# Altium project Mobile Robot.PrjPcb
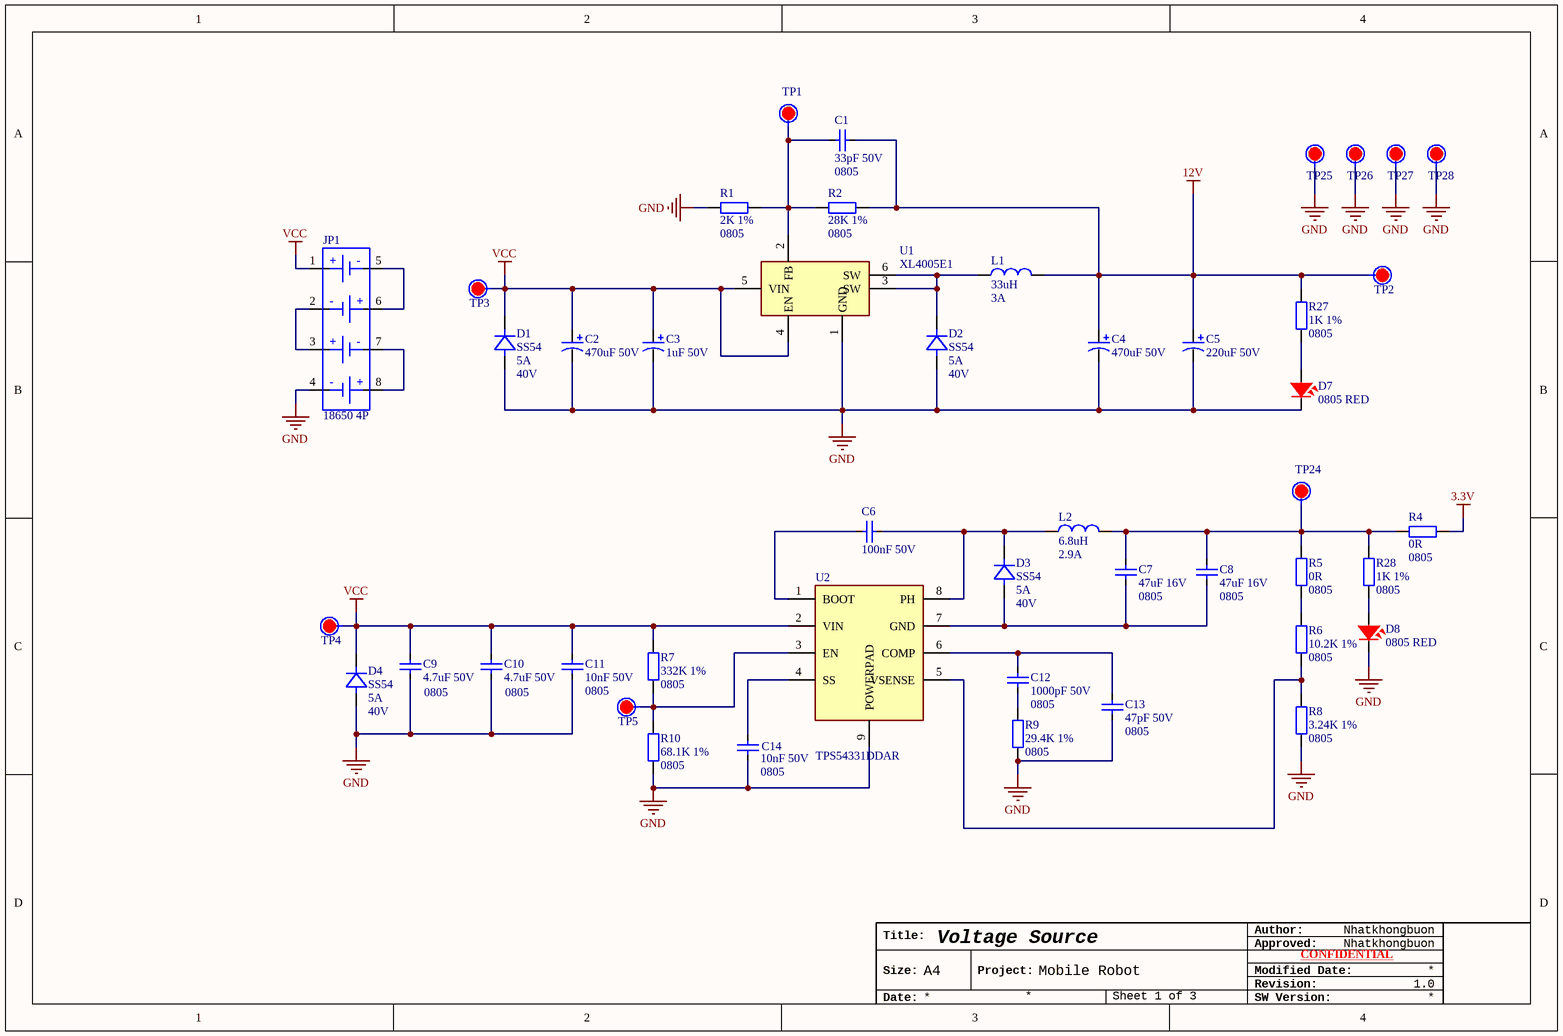
[diagram p0: Voltage Source.SchDoc]
3 sheets, 112 parts. Net scope: global (net labels, ports and power ports of the same name join across sheets).
Board file: PCB.PcbDoc
Sheets:
  Voltage Source.SchDoc
  MCU.SchDoc
  Driver.SchDoc

## Sheet Voltage Source.SchDoc: Voltage Source
size A4; ApprovedBy: Nhatkhongbuon; Author: Nhatkhongbuon; Revision: 1.0; SheetNumber: 1; SheetTotal: 3; ProjectTitle: Mobile Robot

### Parts
C1  33pF 50V  Size: 0805  [CAP_SMD_0805_NEW]
C2  470uF 50V  [CAP-ALU-SMD-D12.5xL13.5]
C3  1uF 50V  [CAP-ALU-SMD-B -NEW]
C4  470uF 50V  [CAP-ALU-SMD-D12.5xL13.5]
C5  220uF 50V  [CAP-ALU-SMD-G-NEW]
C6  100nF 50V  [CAP_SMD_0805_NEW]
C7  47uF 16V  Size: 0805  [CAP_SMD_0805_NEW]
C8  47uF 16V  Size: 0805  [CAP_SMD_0805_NEW]
C9  4.7uF 50V  Size: 0805  [CAP_SMD_0805_NEW]
C10  4.7uF 50V  Size: 0805  [CAP_SMD_0805_NEW]
C11  10nF 50V  Size: 0805  [CAP_SMD_0805_NEW]
C12  1000pF 50V  Size: 0805  [CAP_SMD_0805_NEW]
C13  47pF 50V  Size: 0805  [CAP_SMD_0805_NEW]
C14  10nF 50V  Size: 0805  [CAP_SMD_0805_NEW]
D1  SS54  Current: 5A  DC Voltage: 40V  [SMA]
D2  SS54  Current: 5A  DC Voltage: 40V  [SMA]
D3  SS54  Current: 5A  DC Voltage: 40V  [SMA]
D4  SS54  Current: 5A  DC Voltage: 40V  [SMA]
D7  0805 RED  [LED-0805-Red]
D8  0805 RED  [LED-0805-Red]
JP1  18650 4P  [18650 Holder 4P]
L1  Inductor: 33uH  Current: 3A  [L_TOR_13x7]  (hidden comment: 33uH 3A)
L2  Inductor: 6.8uH  Current: 2.9A  [CD74R]  (hidden comment: CD74R_6.8uH)
R1  2K 1%  Size: 0805  [RES_SMD_0805]
R2  28K 1%  Size: 0805  [RES_SMD_0805]
R4  0R  Size: 0805  [RES_SMD_0805]
R5  0R  Size: 0805  [RES_SMD_0805]
R6  10.2K 1%  Size: 0805  [RES_SMD_0805]
R7  332K 1%  Size: 0805  [RES_SMD_0805]
R8  3.24K 1%  Size: 0805  [RES_SMD_0805]
R9  29.4K 1%  Size: 0805  [RES_SMD_0805]
R10  68.1K 1%  Size: 0805  [RES_SMD_0805]
R27  1K 1%  Size: 0805  [RES_SMD_0805]
R28  1K 1%  Size: 0805  [RES_SMD_0805]
TP1  Test Point  [TEST_POINT]  (value not drawn)
TP2  Test Point  [TEST_POINT]  (value not drawn)
TP3  Test Point  [TEST_POINT]  (value not drawn)
TP4  Test Point  [TEST_POINT]  (value not drawn)
TP5  Test Point  [TEST_POINT]  (value not drawn)
TP24  Test Point  [TEST_POINT]  (value not drawn)
TP25  Test Point  [TEST_POINT]  (value not drawn)
TP26  Test Point  [TEST_POINT]  (value not drawn)
TP27  Test Point  [TEST_POINT]  (value not drawn)
TP28  Test Point  [TEST_POINT]  (value not drawn)
U1  XL4005E1  [TO263-5]
U2  TPS54331DDAR  [TPS54531DDAR]

### Nets
3.3V: R4.1
12V: C1.2 C4.1 C5.1 L1.2 R2.2 R27.1 TP2.1
GND: C2.2 C3.2 C4.2 C5.2 C9.1 C10.1 C11.1 C13.1 C14.1 D1.A D2.A D4.A D7.2 D8.2 JP1.4 R1.1 R8.1 R9.1 R10.1 TP25.1 TP26.1 TP27.1 TP28.1 U1.1(GND) U2.9(POWERPAD)
VCC: C2.1 C3.1 C9.2 C10.2 C11.2 D1.C D4.C JP1.1 R7.2 TP3.1 TP4.1 U1.4(EN) U1.5(VIN) U2.2(VIN)
NetC1_1: C1.1 R1.2 R2.1 TP1.1 U1.2(FB)
NetC6_1: C6.1 U2.1(BOOT)
NetC6_2: C6.2 D3.C L2.1 U2.8(PH)
NetC7_1: C7.1 C8.1 D3.A U2.7(GND)
NetC7_2: C7.2 C8.2 L2.2 R4.2 R5.2 R28.1 TP24.1
NetC12_1: C12.1 R9.2
NetC12_2: C12.2 C13.2 U2.6(COMP)
NetC14_2: C14.2 U2.4(SS)
NetD2_C: D2.C L1.1 U1.3(SW) U1.6(SW)
NetD7_1: D7.1 R27.2
NetD8_1: D8.1 R28.2
NetJP1_2: JP1.2 JP1.3
NetJP1_5: JP1.5 JP1.6
NetJP1_7: JP1.7 JP1.8
NetR5_1: R5.1 R6.2
NetR6_1: R6.1 R8.2 U2.5(VSENSE)
NetR7_1: R7.1 R10.2 TP5.1 U2.3(EN)

### Notes on the sheet
- Author:
- Title:
- Size:
- A4
- Project:
- Approved:
- Revision:
- Modified Date:
- CONFIDENTIAL
- Date:
- SW Version:
- (in symbol 18650_HLD_4P) +; -
- (in symbol XL4005E1) /

### Library data of the parts
C1 = C0805_MLCC_33pF_50V: 33 pF ±10% 50V Ceramic Capacitor C0G, NP0 0805 (2012 Metric); Manufacturer: KEMET; Manufacture Part Number: C0805C330K5GAC7800; Packaging: Cut Tape (CT); Link: https://www.digikey.com/en/products/detail/kemet/C0805C330K5GAC7800/2212525; Price: $0.10
C2 C4 = C_ALU_470uF_50V: 470uF 50V ±20% SMD,D12.5xL13.5mm Aluminum Electrolytic Capacitors - SMD ROHS; Manufacturer: Changzhou Huawei Elec; Manufacture Part Number: VT1H471MI135000CE0; Link: https://www.lcsc.com/product-detail/Aluminum-Electrolytic-Capacitors-SMD_Changzhou-Huawei-Elec-VT1H471MI135000CE0_C191227.html; Price: $ 0.36
C3 = C_ALU_1uF_50V_B: 1uF 50V 7mA@120Hz ±20% SMD,D4xL5.4mm Aluminum Electrolytic Capacitors - SMD ROHS; Manufacturer: KNSCHA; Manufacture Part Number: RST1UF50V017; Packaging: Cut Tape; Link: https://www.lcsc.com/product-detail/Aluminum-Electrolytic-Capacitors-SMD_KNSCHA-RST1UF50V017_C4747972.html; Price: $ 0.0209
C5 = C_ALU_220uF_50V_G: 220uF 50V 220mA@120Hz ±20% SMD,D10xL10.5mm Aluminum Electrolytic Capacitors - SMD ROHS; Manufacturer: KNSCHA; Manufacture Part Number: XT220UF50V90RV0078; Packaging: Cut Tape (CT); Link: https://www.lcsc.com/product-detail/Aluminum-Electrolytic-Capacitors-SMD_KNSCHA-XT220UF50V90RV0078_C2992609.html; Price: $ 0.1071
C6 = C0805_MLCC_100nF_50V: 0.1 µF ±10% 50V Ceramic Capacitor X7R 0805 (2012 Metric); Manufacturer: YAGEO; Manufacture Part Number: CC0805KRX7R9BB104; Packaging: Cut Tape (CT); Link: https://www.digikey.cn/en/products/detail/yageo/CC0805KRX7R9BB104/302874; Price: $0.10; Size: 0805
C7 C8 = C0805_MLCC_47uF_16V: 47 µF ±10% 16V Ceramic Capacitor X5R 1210 (3225 Metric); Manufacturer: Samsung Electro-Mechanics; Manufacture Part Number: CL32A476KOJNNNE; Packaging: Cut Tape (CT); Link: https://www.digikey.cn/en/products/detail/samsung-electro-mechanics/CL32A476KOJNNNE/3889034; Price: $0.51
C9 C10 = C0805_MLCC_4.7uF_50V: 4.7 µF ±10% 50V Ceramic Capacitor X5R 0805 (2012 Metric); Manufacturer: Samsung Electro-Mechanics; Manufacture Part Number: CL21A475KBQNNNE; Packaging: Cut Tape (CT); Link: https://www.digikey.cn/en/products/detail/samsung-electro-mechanics/CL21A475KBQNNNE/3886906; Price: $0.23
C11 C14 = C0805_MLCC_10nF_50V: 10000 pF ±10% 50V Ceramic Capacitor X7R 0805 (2012 Metric); Manufacturer: Samsung Electro-Mechanics; Manufacture Part Number: CL21B103KBANNNC; Packaging: Cut Tape (CT); Link: https://www.digikey.cn/en/products/detail/samsung-electro-mechanics/CL21B103KBANNNC/3886673; Price: $0.10
C12 = C0805_MLCC_1000pF_50V: 1000 pF ±10% 50V Ceramic Capacitor X7R 0805 (2012 Metric); Manufacturer: KEMET; Manufacture Part Number: C0805C102K5RAC7800; Packaging: Cut Tape (CT); Link: https://www.digikey.cn/en/products/detail/kemet/C0805C102K5RAC7800/411146; Price: $0.11
C13 = C0805_MLCC_47pF_50V: 47 pF ±5% 50V Ceramic Capacitor C0G, NP0 0805 (2012 Metric); Manufacturer: YAGEO; Manufacture Part Number: CC0805JRNPO9BN470; Packaging: Cut Tape (CT); Link: https://www.digikey.cn/en/products/detail/yageo/CC0805JRNPO9BN470/302841; Price: $0.10
D1-D4 = SS54: DIODE SCHOTTKY 40V 5A SMA; Manufacturer: EVVO; Manufacture Part Number: SS54; Packaging: Cut Tape (CT); Link: https://www.digikey.cn/en/products/detail/evvo/SS54/21407219; Price: $0.73
D7 D8 = LED_0805_RED: Red 625nm LED Indication - Discrete 2V 0805 (2012 Metric); Manufacturer: Würth Elektronik; Manufacture Part Number: 150080RS75000; Packaging: Cut Tape (CT); Link: https://www.digikey.cn/en/products/detail/w%C3%BCrth-elektronik/150080RS75000/4489918; Price: $0.19
JP1 = 18650_HLD_4P: 18650 Holder 4P; VNese Price: 17000; Link Shopee: https://linhkienchatluong.vn/de-pin---mu-pin/de-4-pin-18650-chan-han-mach-pcb_sp541_ct11852.aspx
L1 = L_33uH_3A: Toroidal Coil Inductor 33uH 3A; VNese Price: 3200; Link Shopee: https://linhkienchatluong.vn/cuon-cam-xuyen/cuon-cam-xuyen-33uh-3a_sp469_ct146.aspx
L2 = CD74R_6.8uH: 2.9A 6.8uH ±30% SMD,7.5x7.5mm Power Inductors ROHS; Manufacturer: SHOU HAN; Manufacture Part Number: CYH74-6.8UH; Link: https://www.lcsc.com/product-detail/Power-Inductors_SHOU-HAN-CYH74-6-8UH_C19268626.html; Price: $ 0.0674
R1 = R0805_2K: 2 kOhms ±1% 0.125W, 1/8W Chip Resistor 0805 (2012 Metric) Automotive AEC-Q200 Thick Film; Manufacturer: Panasonic Electronic Components; Manufacture Part Number: ERJ-6ENF2001V; Packaging: Cut Tape (CT); Link: https://www.digikey.com/en/products/detail/panasonic-electronic-components/ERJ-6ENF2001V/111341; Price: $0.10
R2 = R0805_28K: 28 kOhms ±1% 0.125W, 1/8W Chip Resistor 0805 (2012 Metric) Moisture Resistant Thick Film; Manufacturer: YAGEO; Manufacture Part Number: RC0805FR-0728KL; Packaging: Cut Tape (CT); Link: https://www.digikey.com/en/products/detail/yageo/RC0805FR-0728KL/727788; Price: $0.10
R4 R5 = R0805_0R: 0 Ohms Jumper Chip Resistor 0805 (2012 Metric) Automotive AEC-Q200 Thick Film; Manufacturer: Vishay Dale; Manufacture Part Number: CRCW08050000Z0EA; Packaging: Cut Tape (CT); Link: https://www.digikey.cn/en/products/detail/vishay-dale/CRCW08050000Z0EA/1175125; Price: $0.10
R6 = R0805_10.2K: 10.2 kOhms ±1% 0.125W, 1/8W Chip Resistor 0805 (2012 Metric) Moisture Resistant Thick Film; Manufacturer: YAGEO; Manufacture Part Number: RC0805FR-0710K2L; Packaging: Cut Tape (CT); Link: https://www.digikey.cn/en/products/detail/yageo/RC0805FR-0710K2L/727538; Price: $0.10
R7 = R0805_332K: 332 kOhms ±1% 0.125W, 1/8W Chip Resistor 0805 (2012 Metric) Moisture Resistant Thick Film; Manufacturer: YAGEO; Manufacture Part Number: RC0805FR-07332KL; Packaging: Cut Tape (CT); Price: $0.10; Link: https://www.digikey.cn/en/products/detail/yageo/RC0805FR-07332KL/727869
R8 = R0805_3.24K: 3.24 kOhms ±1% 0.125W, 1/8W Chip Resistor 0805 (2012 Metric) Moisture Resistant Thick Film; Manufacturer: YAGEO; Manufacture Part Number: RC0805FR-073K24L; Packaging: Cut Tape (CT); Link: https://www.digikey.cn/en/products/detail/yageo/RC0805FR-073K24L/727811; Price: $0.10
R9 = R0805_29.4K: 29.4 kOhms ±1% 0.125W, 1/8W Chip Resistor 0805 (2012 Metric) Moisture Resistant Thick Film; Manufacturer: YAGEO; Manufacture Part Number: RC0805FR-0729K4L; Packaging: Cut Tape (CT); Price: $0.10; Link: https://www.digikey.cn/en/products/detail/yageo/RC0805FR-0729K4L/727796
R10 = R0805_68.1K: 68.1 kOhms ±1% 0.125W, 1/8W Chip Resistor 0805 (2012 Metric) Moisture Resistant Thick Film; Manufacturer: YAGEO; Manufacture Part Number: RC0805FR-0768K1L; Packaging: Cut Tape (CT); Price: $0.10; Link: https://www.digikey.cn/en/products/detail/yageo/RC0805FR-0768K1L/728100?s=N4IgTCBcDaIEoGEAMAOJBWAYnAtEg7AGwoDSAjADIgC6AvkA
R27 R28 = R0805_1K: 1 kOhms ±1% 0.125W, 1/8W Chip Resistor 0805 (2012 Metric) Moisture Resistant Thick Film; Manufacturer: YAGEO; Manufacture Part Number: 311-1.00KCRCT-ND; Packaging: Cut Tape (CT); Link: https://www.digikey.com/en/products/detail/yageo/RC0805FR-071KL/727444; Price: $0.10
TP1-TP5 TP24-TP28 = TEST_POINT
U1 = XL4005E1: Step-down type 800mV~30V 5A 5V~32V TO-263-5 DC-DC Converters ROHS; Manufacturer: XLSEMI; Manufacture Part Number: XL4005E1; Link: https://www.lcsc.com/product-detail/DC-DC-Converters_XLSEMI-XL4005E1_C73332.html; Price: $0.68
U2 = TPS54331DDAR: Buck Switching Regulator IC Positive Adjustable 0.8V 1 Output 3A 8-PowerSOIC (0.154", 3.90mm Width); Manufacturer: Texas Instruments; Manufacture Part Number: TPS54331DDAR; Packaging: Cut Tape; Link: https://www.digikey.cn/en/products/detail/texas-instruments/TPS54331DDAR/3053257; Price: $1.88

## Sheet MCU.SchDoc: MCU
size A4; ApprovedBy: Nhatkhongbuon; Author: Nhatkhongbuon; Revision: 1.0; SheetNumber: 2; SheetTotal: 3; ProjectTitle: Mobile Robot
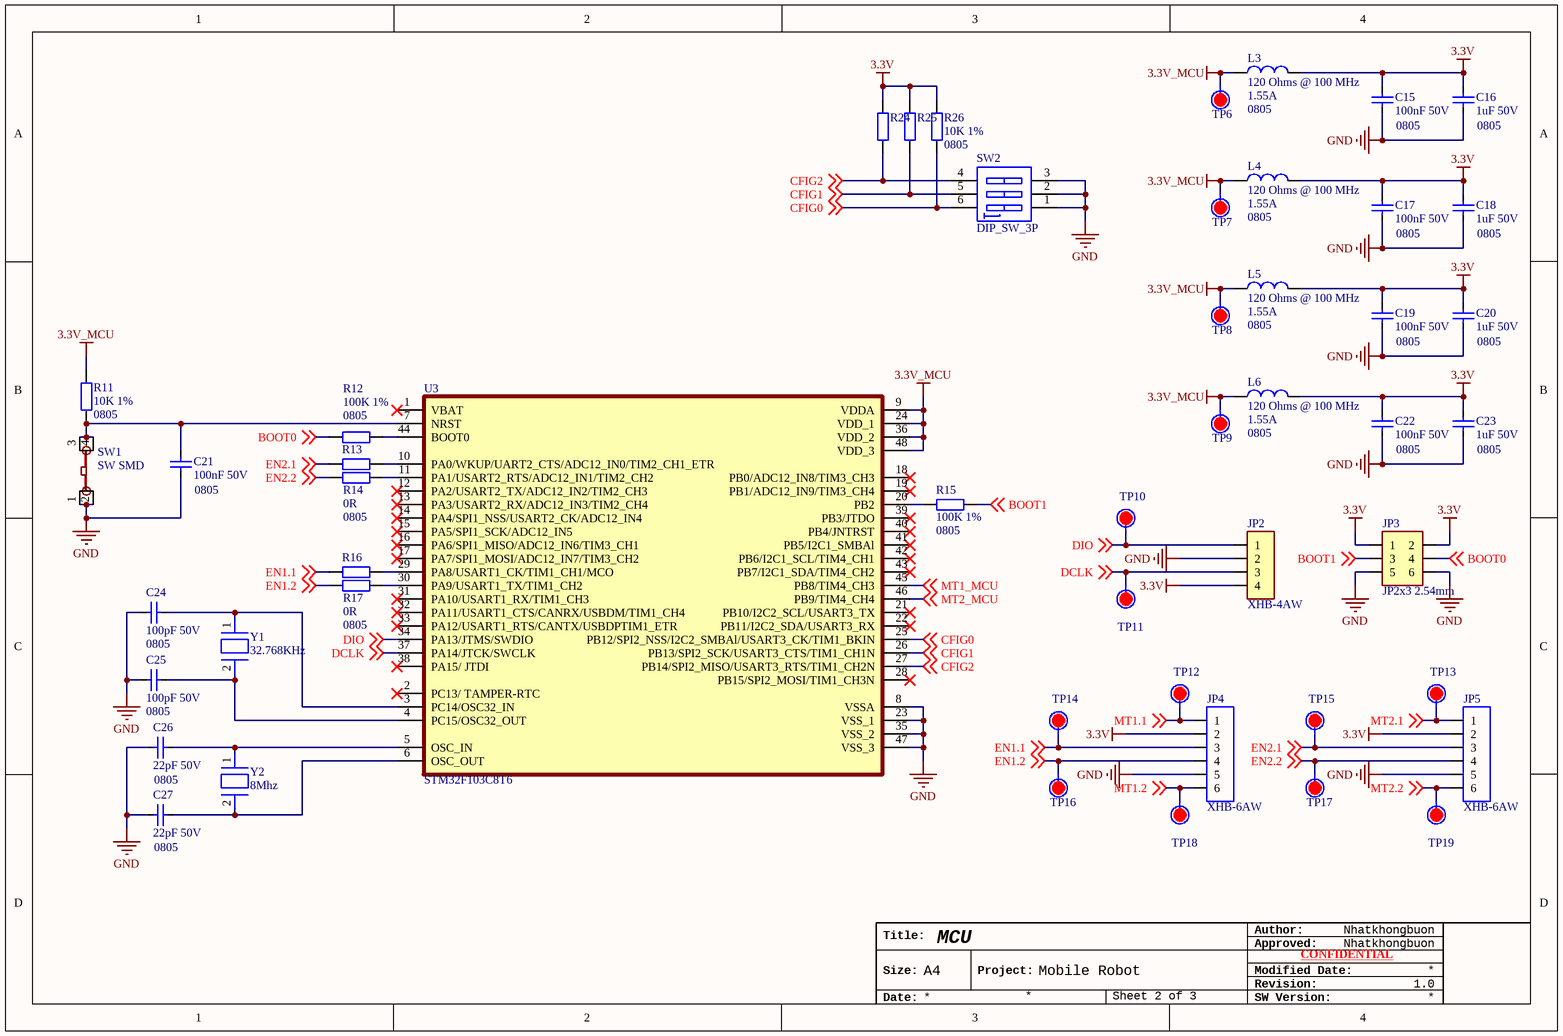
[diagram p1: MCU.SchDoc]

### Parts
C15  100nF 50V  Size: 0805  [CAP_SMD_0805_NEW]
C16  1uF 50V  Size: 0805  [CAP_SMD_0805_NEW]
C17  100nF 50V  Size: 0805  [CAP_SMD_0805_NEW]
C18  1uF 50V  Size: 0805  [CAP_SMD_0805_NEW]
C19  100nF 50V  Size: 0805  [CAP_SMD_0805_NEW]
C20  1uF 50V  Size: 0805  [CAP_SMD_0805_NEW]
C21  100nF 50V  Size: 0805  [CAP_SMD_0805_NEW]
C22  100nF 50V  Size: 0805  [CAP_SMD_0805_NEW]
C23  1uF 50V  Size: 0805  [CAP_SMD_0805_NEW]
C24  100pF 50V  Size: 0805  [CAP_SMD_0805_NEW]
C25  100pF 50V  Size: 0805  [CAP_SMD_0805_NEW]
C26  22pF 50V  Size: 0805  [CAP_SMD_0805_NEW]
C27  22pF 50V  Size: 0805  [CAP_SMD_0805_NEW]
JP2  XHB-4AW  [CONN_XHB-4AW]
JP3  JP2x3 2.54mm  [JP2x3_M]
JP4  XHB-6AW  [XHB-6AW]
JP5  XHB-6AW  [XHB-6AW]
L3  Impedance @ Frequency: 120 Ohms @ 100 MHz  Current: 1.55A  Size: 0805  [FB_0805]  (hidden comment: 120Ohms 100Mhz)
L4  Impedance @ Frequency: 120 Ohms @ 100 MHz  Current: 1.55A  Size: 0805  [FB_0805]  (hidden comment: 120Ohms 100Mhz)
L5  Impedance @ Frequency: 120 Ohms @ 100 MHz  Current: 1.55A  Size: 0805  [FB_0805]  (hidden comment: 120Ohms 100Mhz)
L6  Impedance @ Frequency: 120 Ohms @ 100 MHz  Current: 1.55A  Size: 0805  [FB_0805]  (hidden comment: 120Ohms 100Mhz)
R11  10K 1%  Size: 0805  [RES_SMD_0805]
R12  100K 1%  Size: 0805  [RES_SMD_0805]
R13  0R  [RES_SMD_0805]  (value not drawn)
R14  0R  Size: 0805  [RES_SMD_0805]
R15  100K 1%  Size: 0805  [RES_SMD_0805]
R16  0R  [RES_SMD_0805]  (value not drawn)
R17  0R  Size: 0805  [RES_SMD_0805]
R24  10K 1%  [RES_SMD_0805]  (value not drawn)
R25  10K 1%  [RES_SMD_0805]  (value not drawn)
R26  10K 1%  Size: 0805  [RES_SMD_0805]
SW1  SW SMD  [SMD_6X6X7]
SW2  DIP_SW_3P  [DIPSWITCH3]
TP6  Test Point  [TEST_POINT]  (value not drawn)
TP7  Test Point  [TEST_POINT]  (value not drawn)
TP8  Test Point  [TEST_POINT]  (value not drawn)
TP9  Test Point  [TEST_POINT]  (value not drawn)
TP10  Test Point  [TEST_POINT]  (value not drawn)
TP11  Test Point  [TEST_POINT]  (value not drawn)
TP12  Test Point  [TEST_POINT]  (value not drawn)
TP13  Test Point  [TEST_POINT]  (value not drawn)
TP14  Test Point  [TEST_POINT]  (value not drawn)
TP15  Test Point  [TEST_POINT]  (value not drawn)
TP16  Test Point  [TEST_POINT]  (value not drawn)
TP17  Test Point  [TEST_POINT]  (value not drawn)
TP18  Test Point  [TEST_POINT]  (value not drawn)
TP19  Test Point  [TEST_POINT]  (value not drawn)
U3  STM32F103C8T6  [LQFP-48]
Y1  32.768KHz  [3215_2P]
Y2  8Mhz  [5032_2P]

### Nets
3.3V: C15.2 C16.2 C17.2 C18.2 C19.2 C20.2 C22.2 C23.2 JP2.4 JP3.1 JP3.2 JP4.2 JP5.2 L3.2 L4.2 L5.2 L6.2 R24.1 R25.1 R26.1
3.3V_MCU: L3.1 L4.1 L5.1 L6.1 R11.2 TP6.1 TP7.1 TP8.1 TP9.1 U3.9(VDDA) U3.24(VDD_1) U3.36(VDD_2) U3.48(VDD_3)
GND: C15.1 C16.1 C17.1 C18.1 C19.1 C20.1 C21.1 C22.1 C23.1 C24.1 C25.1 C26.1 C27.1 JP2.2 JP3.5 JP3.6 JP4.5 JP5.5 SW1.1 SW1.2 SW2.1(A1) SW2.2(A2) SW2.3(A3) U3.8(VSSA) U3.23(VSS_1) U3.35(VSS_2) U3.47(VSS_3)
MT1.1: JP4.1 JP5.1 TP12.1 TP13.1 ; off-sheet MT1.1, off-sheet MT2.1  [also labelled MT2.1]  [project net 12V]
BOOT0: JP3.4 R12.1 ; off-sheet BOOT0
BOOT1: JP3.3 R15.2 ; off-sheet BOOT1
CFIG0: R26.2 SW2.6(B1) U3.25(PB12/SPI2_NSS/I2C2_SMBAl/USART3_CK/TIM1_BKIN) ; off-sheet CFIG0
CFIG1: R25.2 SW2.5(B2) U3.26(PB13/SPI2_SCK/USART3_CTS/TIM1_CH1N) ; off-sheet CFIG1
CFIG2: R24.2 SW2.4(B3) U3.27(PB14/SPI2_MISO/USART3_RTS/TIM1_CH2N) ; off-sheet CFIG2
DCLK: JP2.3 TP11.1 U3.37(PA14/JTCK/SWCLK) ; off-sheet DCLK
DIO: JP2.1 TP10.1 U3.34(PA13/JTMS/SWDIO) ; off-sheet DIO
EN1.1: JP4.3 R16.1 TP14.1 ; off-sheet EN1.1
EN1.2: JP4.4 R17.1 TP16.1 ; off-sheet EN1.2
EN2.1: JP5.3 R13.1 TP15.1 ; off-sheet EN2.1
EN2.2: JP5.4 R14.1 TP17.1 ; off-sheet EN2.2
MT1.2: JP4.6 TP18.1 ; off-sheet MT1.2
MT1_MCU: U3.45(PB8/TIM4_CH3) ; off-sheet MT1_MCU
MT2.2: JP5.6 TP19.1 ; off-sheet MT2.2
MT2_MCU: U3.46(PB9/TIM4_CH4) ; off-sheet MT2_MCU
NetC21_2: C21.2 R11.1 SW1.3 SW1.4 U3.7(NRST)
NetC24_2: C24.2 U3.3(PC14/OSC32_IN) Y1.1
NetC25_2: C25.2 U3.4(PC15/OSC32_OUT) Y1.2
NetC26_2: C26.2 U3.5(OSC_IN) Y2.1
NetC27_2: C27.2 U3.6(OSC_OUT) Y2.2
NetR12_2: R12.2 U3.44(BOOT0)
NetR13_2: R13.2 U3.10(PA0/WKUP/UART2_CTS/ADC12_IN0/TIM2_CH1_ETR)
NetR14_2: R14.2 U3.11(PA1/USART2_RTS/ADC12_IN1/TIM2_CH2)
NetR15_1: R15.1 U3.20(PB2)
NetR16_2: R16.2 U3.29(PA8/USART1_CK/TIM1_CH1/MCO)
NetR17_2: R17.2 U3.30(PA9/USART1_TX/TIM1_CH2)

Not connected (* = marked no-connect by the designer): U3 1(VBAT)* 2(PC13/_TAMPER-RTC)* 12(PA2/USART2_TX/ADC12_IN2/TIM2_CH3)* 13(PA3/USART2_RX/ADC12_IN3/TIM2_CH4)* 14(PA4/SPI1_NSS/USART2_CK/ADC12_IN4)* 15(PA5/SPI1_SCK/ADC12_IN5)* 16(PA6/SPI1_MISO/ADC12_IN6/TIM3_CH1)* 17(PA7/SPI1_MOSI/ADC12_IN7/TIM3_CH2)* 18(PB0/ADC12_IN8/TIM3_CH3)* 19(PB1/ADC12_IN9/TIM3_CH4)* 21(PB10/I2C2_SCL/USART3_TX)* 22(PB11/I2C2_SDA/USART3_RX)* 28(PB15/SPI2_MOSI/TIM1_CH3N)* 31(PA10/USART1_RX/TIM1_CH3)* 32(PA11/USART1_CTS/CANRX/USBDM/TIM1_CH4)* 33(PA12/USART1_RTS/CANTX/USBDPTIM1_ETR)* 38(PA15/_JTDI)* 39(PB3/JTDO)* 40(PB4/JNTRST)* 41(PB5/I2C1_SMBAl)* 42(PB6/I2C1_SCL/TIM4_CH1)* 43(PB7/I2C1_SDA/TIM4_CH2)*

### Notes on the sheet
- Author:
- Title:
- Size:
- A4
- Project:
- Approved:
- Revision:
- Modified Date:
- CONFIDENTIAL
- Date:
- SW Version:

### Library data of the parts
C15 C17 C19 C21 C22 = C0805_MLCC_100nF_50V: as C6 on sheet Voltage Source; Packaging: Cut Tape (CT); Link: https://www.digikey.cn/en/products/detail/yageo/CC0805KRX7R9BB104/302874; Price: $0.10
C16 C18 C20 C23 = C0805_MLCC_1uF_50V: 1 µF ±10% 50V Ceramic Capacitor X7R 0805 (2012 Metric); Manufacturer: Samsung Electro-Mechanics; Manufacture Part Number: CL21B105KBFNNNG; Packaging: Cut Tape (CT); Link: https://www.digikey.cn/en/products/detail/samsung-electro-mechanics/CL21B105KBFNNNG/3894467; Price: $0.11
C24 C25 = C0805_MLCC_100pF_50V: 100 pF ±5% 50V Ceramic Capacitor C0G, NP0 0805 (2012 Metric); Manufacturer: KEMET; Manufacture Part Number: C0805C101J5GAC7800; Packaging: Cut Tape (CT); Link: https://www.digikey.com/en/products/detail/kemet/C0805C101J5GAC7800/411121?s=N4IgTCBcDaIMIAYAcCCscCMCMClUHEBBOAdhQRAF0BfIA; Price: $0.11
C26 C27 = C0805_MLCC_22pF_50V: 22 pF ±1% 250V Ceramic Capacitor C0G, NP0 0805 (2012 Metric); Manufacturer: KYOCERA AVX; Manufacture Part Number: 600F220FT250XT; Packaging: Cut Tape (CT); Link: https://www.digikey.cn/en/products/detail/kyocera-avx/600F220FT250XT/3905100; Price: $2.26
JP2 = XHB-4AW: 1x4P 4P 1 2.5mm 4 Right-Angle Push-Pull,P=2.5mm Wire To Board Connector ROHS; Manufacturer: BOOMELE(Boom Precision Elec); Manufacture Part Number: XHB-4AW; Link: https://www.lcsc.com/product-detail/Wire-To-Board-Connector_BOOMELE-Boom-Precision-Elec-XHB-4AW_C95476.html; Price: $ 0.0230
JP3 = JP2x3M: Direct Insert 6P 2.54mm Double Row Black Plugin,P=2.54mm Pin Headers ROHS; Manufacturer: BOOMELE(Boom Precision Elec); Manufacture Part Number: 2.54-2*3P; Packaging: Bulk; Link: https://www.lcsc.com/product-detail/Pin-Headers_BOOMELE-Boom-Precision-Elec-2-54-2-3P_C65114.html; Price: $ 0.0289
JP4 JP5 = XHB-6AW: 1x6P 6P 1 2.5mm 6 Bend insert Push-Pull,P=2.5mm Wire To Board Connector ROHS; Manufacturer: BOOMELE(Boom Precision Elec); Manufacture Part Number: XHB-6AW; Link: https://www.lcsc.com/product-detail/Wire-To-Board-Connector_BOOMELE-Boom-Precision-Elec-XHB-6AW_C66056.html; Price: $ 0.0334
L3-L6 = FR_120Ohms_100Mhz: Manufacturer: Murata Electronics; Manufacture Part Number: BLM21PG121BH1D; Packaging: Cut Tape (CT); Link: https://www.digikey.cn/en/products/detail/murata-electronics/BLM21PG121BH1D/10702696; Price: $0.18
R11 R24-R26 = R0805_10K: 10 kOhms ±1% 0.125W, 1/8W Chip Resistor 0805 (2012 Metric) Moisture Resistant Thick Film; Manufacturer: YAGEO; Manufacture Part Number: RC0805FR-0710KL; Packaging: Cut Tape (CT); Price: $0.10; Link: https://www.digikey.cn/en/products/detail/yageo/RC0805FR-0710KL/727535
  R24 R25: Size: 0805
R12 R15 = R0805_100K: 100 kOhms ±1% 0.125W, 1/8W Chip Resistor 0805 (2012 Metric) Moisture Resistant Thick Film; Manufacturer: YAGEO; Manufacture Part Number: RC0805FR-07100KL; Packaging: Cut Tape (CT); Link: https://www.digikey.cn/en/products/detail/yageo/RC0805FR-07100KL/727544; Price: $0.10
R13 R14 R16 R17 = R0805_0R: as R4 on sheet Voltage Source; Packaging: Cut Tape (CT); Link: https://www.digikey.cn/en/products/detail/vishay-dale/CRCW08050000Z0EA/1175125; Price: $0.10
  R13 R16: Size: 0805
SW1 = SW_SMD_6X6X7: 不带 6mm 7mm 50mA Round Button Brick nogging SPST 6mm 8万次 12V SMD Tactile Switches ROHS; Manufacturer: Shenzhen Kinghelm Elec; Manufacture Part Number: KH-6X6X7H-STM; Link: https://www.lcsc.com/product-detail/Tactile-Switches_Shenzhen-Kinghelm-Elec-KH-6X6X7H-STM_C2837533.html; Price: $ 0.0185
SW2 = DIP_SW_3P: Dip Switch SPST 3 Position Through Hole Slide (Standard) Actuator 25mA 24VDC; Manufacturer: CIT Relay and Switch; Manufacture Part Number: KG03E; Packaging: Tube; Link: https://www.digikey.cn/en/products/detail/cit-relay-and-switch/KG03E/15294176; Price: $0.65
TP6-TP19 = TEST_POINT
U3 = STM32F103C8T6: ARM® Cortex®-M3 STM32F1 Microcontroller IC 32-Bit Single-Core 72MHz 64KB (64K x 8) FLASH; Manufacturer: STMicroelectronics; Manufacture Part Number: STM32F103C8T6; Packaging: Tray; Link: https://www.digikey.cn/en/products/detail/stmicroelectronics/STM32F103C8T6/1646338; Price: $6.11
Y1 = 3215_2P_32.768KHz: 32.768kHz Surface Mount Crystal 12.5pF ±20ppm SMD3215-2P Crystals ROHS; Manufacturer: Yajingxin; Manufacture Part Number: TCXM32768K2NGDCZT2T; VNese Price: 4700; Packaging: Cut Tape; Link: https://www.lcsc.com/product-detail/Crystals_Yajingxin-TCXM32768K2NGDCZT2T_C145167.html; Price: $ 0.1930; Link Shopee: https://linhkien.cxt.vn/2947-fc-135-thach-anh-32768khz-125pf-3215.html
Y2 = 5032_2P_8MHz: 8MHz  20pF ±30ppm ±30ppm SMD5032 Crystals ROHS; Manufacturer: TAITIEN Elec; Manufacture Part Number: XSHEELNANF-16MHZ; VNese Price: 4400; Packaging: Cut Tape; Link: https://www.lcsc.com/product-detail/Crystals_TAITIEN-Elec-XSHEELNANF-8MHZ_C242219.html; Price: $ 0.3251; Link Shopee: https://linhkien.cxt.vn/1388-thach-anh-5032-2-chan-dan.html

## Sheet Driver.SchDoc: Driver
size A4; ApprovedBy: Nhatkhongbuon; Author: Nhatkhongbuon; Revision: 1.0; SheetNumber: 3; SheetTotal: 3; ProjectTitle: Mobile Robot
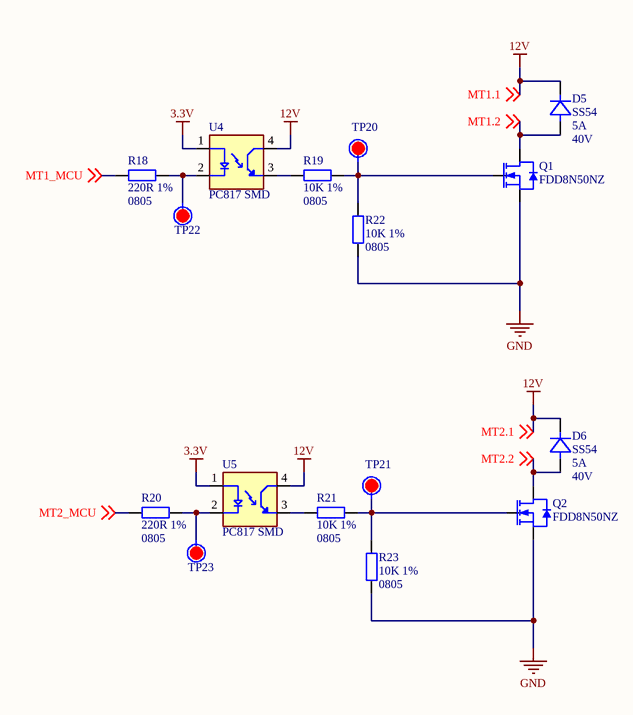
[diagram p2: Driver.SchDoc]

### Parts
D5  SS54  Current: 5A  DC Voltage: 40V  [SMA]
D6  SS54  Current: 5A  DC Voltage: 40V  [SMA]
Q1  FDD8N50NZ  [TO252-2]
Q2  FDD8N50NZ  [TO252-2]
R18  220R 1%  Size: 0805  [RES_SMD_0805]
R19  10K 1%  Size: 0805  [RES_SMD_0805]
R20  220R 1%  Size: 0805  [RES_SMD_0805]
R21  10K 1%  Size: 0805  [RES_SMD_0805]
R22  10K 1%  Size: 0805  [RES_SMD_0805]
R23  10K 1%  Size: 0805  [RES_SMD_0805]
TP20  Test Point  [TEST_POINT]  (value not drawn)
TP21  Test Point  [TEST_POINT]  (value not drawn)
TP22  Test Point  [TEST_POINT]  (value not drawn)
TP23  Test Point  [TEST_POINT]  (value not drawn)
U4  PC817 SMD  [PC817XL_SMD]
U5  PC817 SMD  [PC817XL_SMD]

### Nets
3.3V: U4.1(A) U5.1(A)
12V: D5.C D6.C U4.4(CT) U5.4(CT) ; off-sheet MT1.1, off-sheet MT2.1  [also labelled MT1.1, MT2.1]
GND: Q1.3(S) Q2.3(S) R22.1 R23.1
MT1.2: D5.A Q1.2(D) ; off-sheet MT1.2
MT1_MCU: R18.2 ; off-sheet MT1_MCU
MT2.2: D6.A Q2.2(D) ; off-sheet MT2.2
MT2_MCU: R20.2 ; off-sheet MT2_MCU
NetQ1_1: Q1.1(G) R19.2 R22.2 TP20.1
NetQ2_1: Q2.1(G) R21.2 R23.2 TP21.1
NetR18_1: R18.1 TP22.1 U4.2(C)
NetR19_1: R19.1 U4.3(ET)
NetR20_1: R20.1 TP23.1 U5.2(C)
NetR21_1: R21.1 U5.3(ET)

### Notes on the sheet
- Author:
- Title:
- Size:
- A4
- Project:
- Approved:
- Revision:
- Modified Date:
- CONFIDENTIAL
- Date:
- SW Version:

### Library data of the parts
D5 D6 = SS54: as D1 on sheet Voltage Source; Manufacture Part Number: SS54; Packaging: Cut Tape (CT); Link: https://www.digikey.cn/en/products/detail/evvo/SS54/21407219; Price: $0.73
Q1 Q2 = FDD8N50NZ: 650V 7A 1 N-Channel TO-252 MOSFETs ROHS; Manufacturer: VBsemi Elec; Manufacture Part Number: FDD8N50NZTM-VB; Packaging: Tube; Link: https://www.lcsc.com/product-detail/MOSFETs_VBsemi-Elec-FDD8N50NZTM-VB_C7525025.html; Price: $ 0.57; Drain to Source Voltage (Vdss): 650V; Current - Continuous Drain (Id) @ 25°C: 7A; FET Type: N-Channel
R18 R20 = R0805_220R: 220 Ohms ±1% 0.125W, 1/8W Chip Resistor 0805 (2012 Metric) Automotive AEC-Q200, Moisture Resistant Thick Film; Manufacturer: TE Connectivity Passive Product; Manufacture Part Number: CRGCQ0805F220R; Packaging: Cut Tape (CT); Link: https://www.digikey.cn/en/products/detail/te-connectivity-passive-product/CRGCQ0805F220R/8576343; Price: $0.10
R19 R21-R23 = R0805_10K: as R11 on sheet MCU; Packaging: Cut Tape (CT); Price: $0.10; Link: https://www.digikey.cn/en/products/detail/yageo/RC0805FR-0710KL/727535
TP20-TP23 = TEST_POINT
U4 U5 = PC817_SMD: Optoisolator Transistor Output 5000Vrms 1 Channel 4-SMD; Manufacturer: American Bright Optoelectronics Corporation; Manufacture Part Number: APC-817C1-SL; Packaging: Cut Tape (CT); Link: https://www.digikey.cn/en/products/detail/american-bright-optoelectronics-corporation/APC-817C1-SL/16273175; Price: $0.43

## Nets that join several sheets
3.3V: Voltage Source (R4.1), MCU (20 pins), Driver (U4.1 U5.1)
12V: Voltage Source (7 pins), MCU (JP4.1 JP5.1 TP12.1 TP13.1), Driver (D5.C D6.C U4.4 U5.4)
GND: Voltage Source (25 pins), MCU (27 pins), Driver (Q1.3 Q2.3 R22.1 R23.1)
MT1.2: MCU (JP4.6 TP18.1), Driver (D5.A Q1.2)
MT1_MCU: MCU (U3.45), Driver (R18.2)
MT2.2: MCU (JP5.6 TP19.1), Driver (D6.A Q2.2)
MT2_MCU: MCU (U3.46), Driver (R20.2)